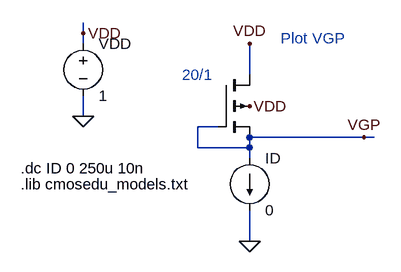
[diagram p0: schematic Fig26_1_pmos.asc]
Fig26_1_pmos.asc, the LTspice schematic file:
Version 4
SHEET 1 1136 680
WIRE 192 -368 192 -384
WIRE 192 -352 192 -368
WIRE 192 -240 192 -272
WIRE 368 -192 368 -224
WIRE 400 -224 368 -224
WIRE 448 -304 448 -352
WIRE 448 -192 368 -192
WIRE 448 -192 448 -208
WIRE 448 -176 448 -192
WIRE 448 -48 448 -96
WIRE 624 -208 448 -208
WIRE 640 -208 624 -208
FLAG 192 -240 0
FLAG 192 -368 VDD
FLAG 448 -256 VDD
FLAG 448 -48 0
FLAG 448 -352 VDD
FLAG 624 -208 VGP
SYMBOL voltage 192 -368 R0
WINDOW 123 0 0 Left 0
WINDOW 39 0 0 Left 0
SYMATTR InstName VDD
SYMATTR Value 1
SYMBOL pmos4 400 -304 R0
WINDOW 0 88 9 Invisible 0
WINDOW 3 168 20 Invisible 0
SYMATTR InstName M2
SYMATTR Value P_50n
SYMATTR Value2 l=50n w=1u
SYMBOL current 448 -176 R0
SYMATTR InstName ID
SYMATTR Value 0
TEXT 96 -160 Left 0 !.dc ID 0 250u 10n
TEXT 96 -136 Left 0 !.lib cmosedu_models.txt
TEXT 496 -360 Left 0 ;Plot VGP
TEXT 344 -304 Left 0 ;20/1

The netlist it stands for:
* Fig26_1_pmos.asc
VDD VDD 0 1
M2 VDD VGP VGP VDD P_50n l=50n w=1u
ID VGP 0 0
.model NMOS NMOS
.model PMOS PMOS
.lib standard.mos
.dc ID 0 250u 10n
.lib cmosedu_models.txt
* Plot VGP
* 20/1
.backanno
.end